# EasyEDA schematic ecoluz_2021-05-16.json
TITLE: EcoLuz; REV: 1.0; Date: 2021-05-16; Sheet: 1/1; Drawn By: Jonathas Amaral; Company: Guilda Maker
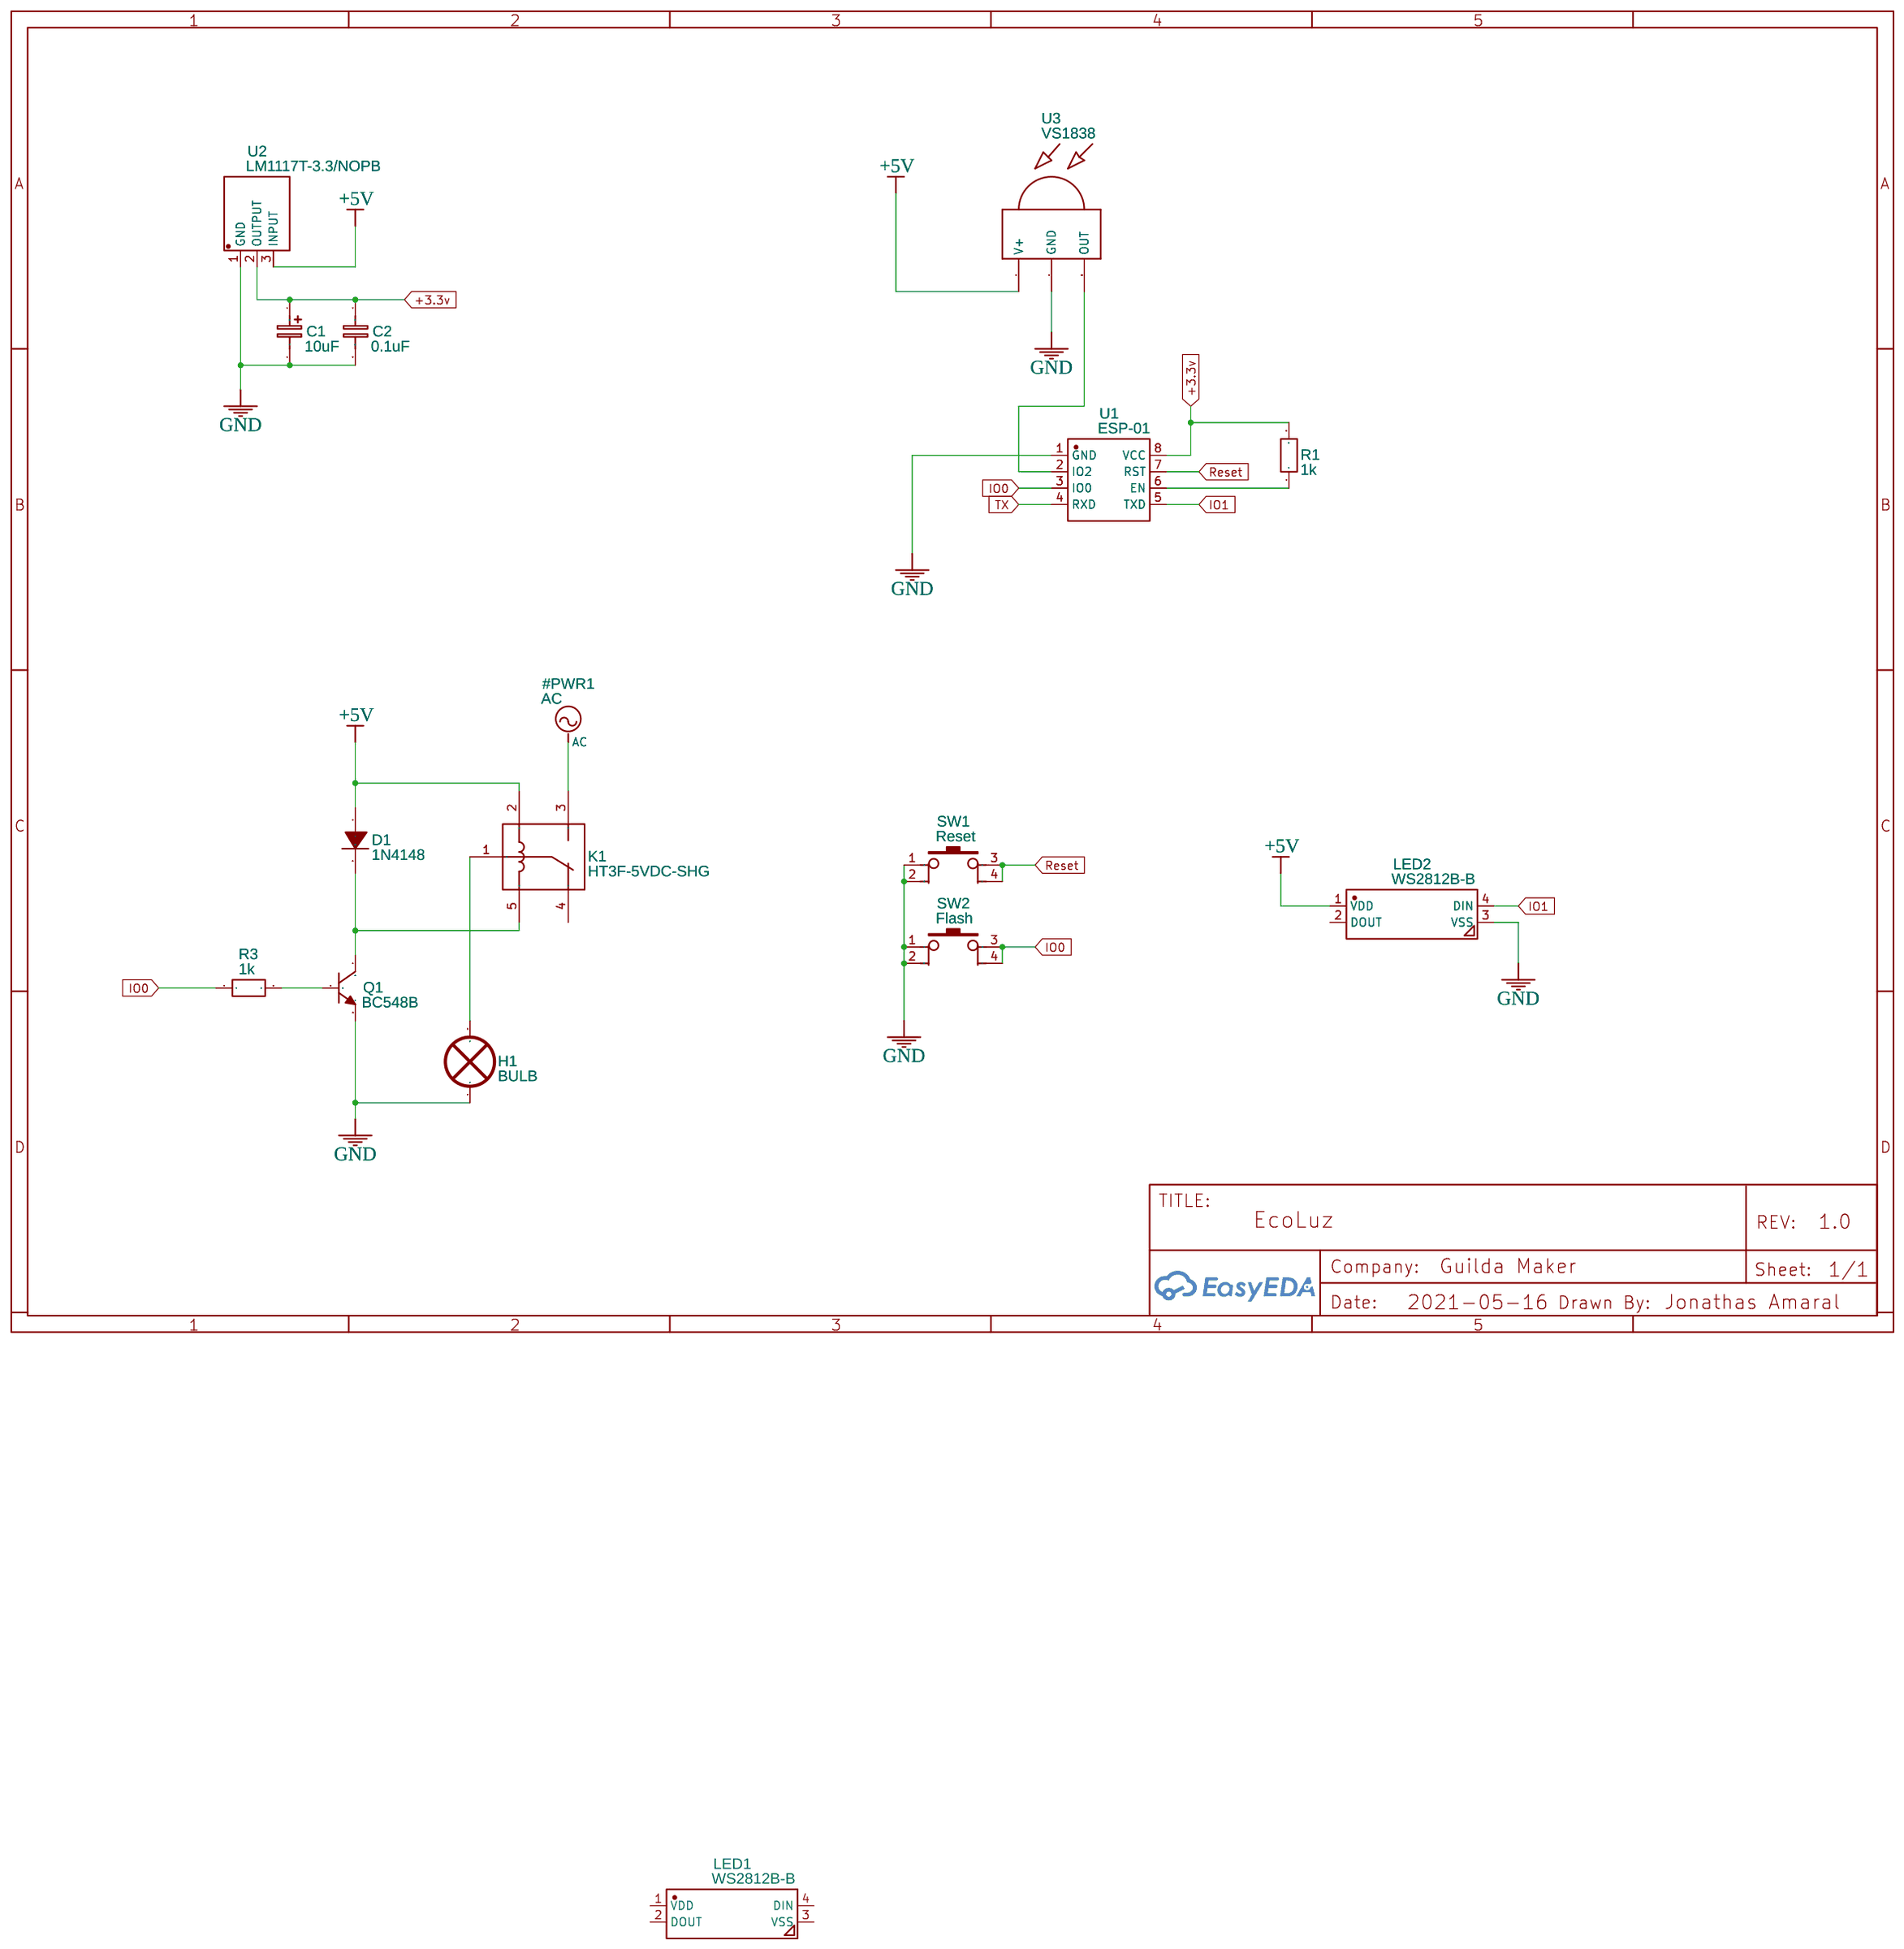
[diagram p0: schematic sheet]

## Parts
#PWR1  AC
C1  10uF  [CASE-A_3216]
C2  0.1uF  [RAD-0.1]
D1  1N4148  [DO-35_BD2.0-L4.0-P8.00-D0.5-FD]
H1  BULB  [IND2-N10]
K1  HT3F-5VDC-SHG  [RELAY-TH_HT3F-DCXX-X-X]
LED1  WS2812B-B  [LED-SMD_4P-L5.0-W5.0-TL_WS2812B-B]
LED2  WS2812B-B  [LED-SMD_4P-L5.0-W5.0-TL_WS2812B-B]
Q1  BC548B  [TO-92-3_L4.9-W3.7-P1.27-L]
R1  1k  [R0603]
R3  1k  [R0603]
SW1  Reset  [SW-SMD_4P-L6.0-W6.0-P4.50-LS8.5]
SW2  Flash  [SW-SMD_4P-L6.0-W6.0-P4.50-LS8.5]
U1  ESP-01  [WIFIM-TH_8P-L24.7-W14.4-P2.54]
U2  LM1117T-3.3/NOPB  [TO-220-3_L10.0-W4.5-P2.54-L]
U3  VS1838  [TSOP18XX]

## Library data of the parts
#PWR1 = AC: Contributor: KiCAD; license: https://www.gnu.org/licenses/lgpl-2.1.html
C1 = C_Tan_SMD_A_EU: Contributor: LCEDA_Lib
C2 = C_RAD-0.1_EU: Contributor: LCEDA_Lib
D1 = 1N4148: Supplier: LCSC; Manufacturer: SEMTECH; image: //image.lceda.cn/szlcsc/C14516.jpg; Supplier Part: C14516; JLCPCB Part Class: Extended Part
H1 = BULB
K1 = HT3F-5VDC-SHG: Supplier: LCSC; Manufacturer: HTV; Contributor: LCSC; Supplier Part: C129113
LED1 LED2 = WS2812B-B: Supplier: LCSC; Manufacturer: Worldsemi; Contributor: LCSC; Supplier Part: C114586; JLCPCB Part Class: Extended Part
Q1 = BC548B: Supplier: LCSC; Manufacturer: CJ; image: //image.lceda.cn/szlcsc/C36611.jpg; Supplier Part: C36611; JLCPCB Part Class: Extended Part
R1 R3 = R_0603_EU: Contributor: LCEDA_Lib
SW1 SW2 = Switch-SMD-6x6x11: Supplier Part: C91998; Supplier: LCSC; Manufacturer: BBJ; Manufacturer Part: Switch6*6*11
U1 = ESP-01: Supplier: LCSC; Supplier Part: C503581; Manufacturer: Ai-Thinker; Contributor: LCSC
U2 = LM1117T-3.3/NOPB: Supplier: LCSC; Supplier Part: C201726; Manufacturer: Texas Instruments; Contributor: LCSC; JLCPCB Part Class: Extended Part
U3 = VS1838

## Nets
+3.3v: C1.1 C2.1 R1.2 U1.8(VCC) U2.2(OUTPUT)
+5V: D1.1(A) K1.2 LED2.1(VDD) U2.3(INPUT) U3.VCC(V+)
GND: C1.2 C2.2 H1.1 LED2.3(VSS) Q1.3(E) SW1.1 SW1.2 SW2.1 SW2.2 U1.1(GND) U2.1(GND) U3.GND
IO0: R3.1 SW2.3 SW2.4 U1.3(IO0)
IO1: LED2.4(DIN) U1.5(TXD)
Reset: SW1.3 SW1.4 U1.7(RST)
TX: U1.4(RXD)
Net-(#PWR1-1): #PWR1.1(AC) K1.3
Net-(D1-2): D1.2(C) K1.5 Q1.1(C)
Net-(H1-2): H1.2 K1.1
Net-(Q1-2): Q1.2(B) R3.2
Net-(R1-1): R1.1 U1.6(EN)
Net-(U1-2): U1.2(IO2) U3.OUT

Not connected (* = marked no-connect by the designer): K1 4; LED1 1(VDD) 2(DOUT) 3(VSS) 4(DIN); LED2 2(DOUT)
